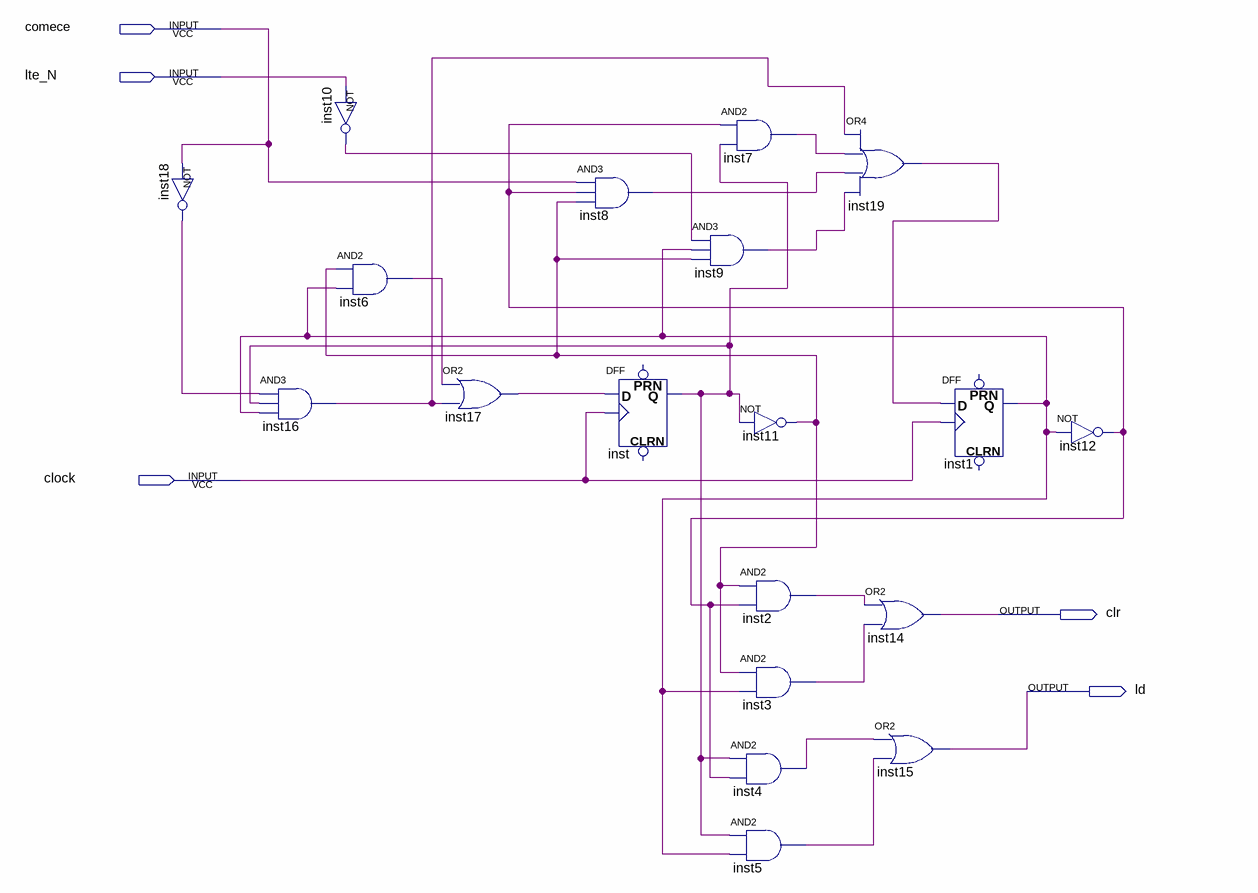
[diagram p0: schematic sheet]
// Quartus schematic Controle.bdf as structural Verilog: 19 symbols, 5 pins
module Controle (
  input  comece,
  input  lte_N,
  input  clock,
  output clr,
  output ld
);

  wire inst1_q, inst2_out, inst3_out, inst4_out, inst5_out, inst6_out, inst7_out, inst8_out, inst9_out,
       inst10_out, inst11_out, inst12_out, inst16_out, inst17_out, inst18_out, inst19_out, inst_q;

  not inst18 (inst18_out, comece);
  and inst16 (inst16_out, inst18_out, inst_q, inst1_q);
  not inst10 (inst10_out, lte_N);
  and inst6 (inst6_out, inst11_out, inst1_q);
  or inst17 (inst17_out, inst6_out, inst16_out);
  and inst8 (inst8_out, comece, inst12_out, inst11_out);
  DFF inst (.CLK(clock), .D(inst17_out), .Q(inst_q));  // open: CLRN, PRN
  and inst7 (inst7_out, inst12_out, inst_q);
  and inst9 (inst9_out, inst10_out, inst1_q, inst11_out);
  not inst11 (inst11_out, inst_q);
  and inst2 (inst2_out, inst11_out, inst12_out);
  and inst3 (inst3_out, inst11_out, inst1_q);
  and inst4 (inst4_out, inst_q, inst12_out);
  and inst5 (inst5_out, inst_q, inst1_q);
  or inst19 (inst19_out, inst16_out, inst7_out, inst8_out, inst9_out);
  or inst14 (clr, inst2_out, inst3_out);
  or inst15 (ld, inst4_out, inst5_out);
  DFF inst1 (.CLK(clock), .D(inst19_out), .Q(inst1_q));  // open: CLRN, PRN
  not inst12 (inst12_out, inst1_q);
endmodule
